# EAGLE design piezo-jfet-buffer-simple-2x v2 (EAGLE 7.5.0)
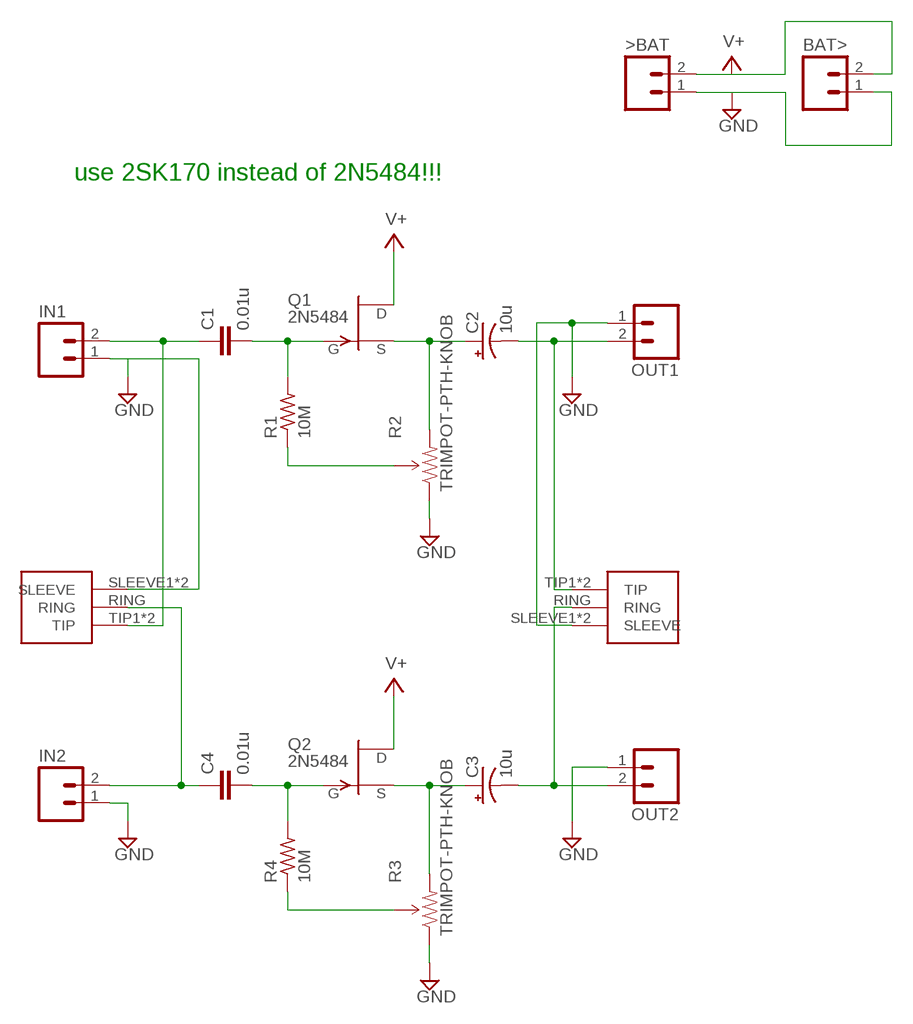
[diagram p0: schematic, sheet 1]

## Parts
>BAT  M02PTH  [1X02]
BAT>  M02PTH  [1X02]
C1  0.01u  C5/3  [C5B3]
C2  10u  CAP_POLPTH2  [CPOL-RADIAL-10UF-25V]
C3  10u  CAP_POLPTH2  [CPOL-RADIAL-10UF-25V]
C4  0.01u  C5/3  [C5B3]
IN1  M02LOCK  [1X02_LOCK]
IN2  M02LOCK  [1X02_LOCK]
OUT1  M02LOCK  [1X02_LOCK]
OUT2  M02LOCK  [1X02_LOCK]
Q1  2N5484  [TO92-]
Q2  2N5484  [TO92-]
R1  10M  R-US_0204/2V  [0204V]
R2  TRIMPOT-PTH-KNOB  [3386U]
R3  TRIMPOT-PTH-KNOB  [3386U]
R4  10M  R-US_0204/2V  [0204V]
U$1  1/8"-F-STEREO-PCB  [1/8"-F-STEREO-PCB]
U$2  1/8"-F-STEREO-PCB  [1/8"-F-STEREO-PCB]

## Nets
CH1: C2.2(-) OUT1.2 U$1.TIP1(TIP) U$1.TIP2(TIP)
CH2: C3.2(-) OUT2.2 U$1.RING
GND: >BAT.1 BAT>.1 IN1.1 IN2.1 OUT1.1 OUT2.1 R2.1(CCW) R3.1(CCW) U$1.SLEEVE1(SLEEVE) U$1.SLEEVE2(SLEEVE) U$2.SLEEVE1(SLEEVE) U$2.SLEEVE2(SLEEVE)
JFET-GATE: C1.2 Q1.1(G) R1.2
JFET-GATE1: C4.2 Q2.1(G) R4.2
JFET-SOURCE: C2.1(+) Q1.2(S) R2.3(CW)
JFET-SOURCE1: C3.1(+) Q2.2(S) R3.3(CW)
N$1: R3.2(WIPER) R4.1
N$2: C1.1 IN1.2 U$2.TIP1(TIP) U$2.TIP2(TIP)
N$3: R1.1 R2.2(WIPER)
N$4: C4.1 IN2.2 U$2.RING
V+: >BAT.2 BAT>.2 Q1.3(D) Q2.3(D)

## Notes on the sheet
- use 2SK170 instead of 2N5484!!!

## Library data of the parts
>BAT BAT> IN1 IN2 OUT1 OUT2 = SparkFun-Connectors:M02: Header 2 Standard 2-pin 0.1" header. Use with straight break away headers (SKU : PRT-00116), right angle break away headers (PRT-00553), swiss pins (PRT-00743), machine pins (PRT-00117), and female headers (PRT-00115). Molex polarized connector foot print use with SKU : PRT-08233 with associated crimp pins and housings.
C1 C4 = capacitor-wima:C: CAPACITOR naming: grid - package width
C2 C3 = SparkFun-Passives:CAP_POL: Capacitor Polarized These are standard SMD and PTH capacitors. Normally 10uF, 47uF, and 100uF in electrolytic and tantalum varieties. Always verify the external diameter of the through hole cap, it varies with capacity, voltage, and manufacturer. The EIA devices should be standard.
Q1 Q2 = transistor-fet:?548*: N-Channel JFETs Source: VISHAY 2N5484.pdf Compatible: TO92 2N5245 J304 J305 U310 J308 J309 J310 TO72 2N4416 2N4416A 2N3823 2N4351 3N169 3N170 3N171 MFE3002 TO18 2N3796 2N3797 MFE825 Source: Motorola European Master Guide Pacge 3-59
R1 R4 = resistor:R-US_: RESISTOR, American symbol
R2 R3 = SparkFun-Electromechanical:TRIMPOT: Various small potentiometers for "set-and-forget" applications
U$1 U$2 = CMU-ArtFab:1/8"-F-STEREO-PCB

## Board
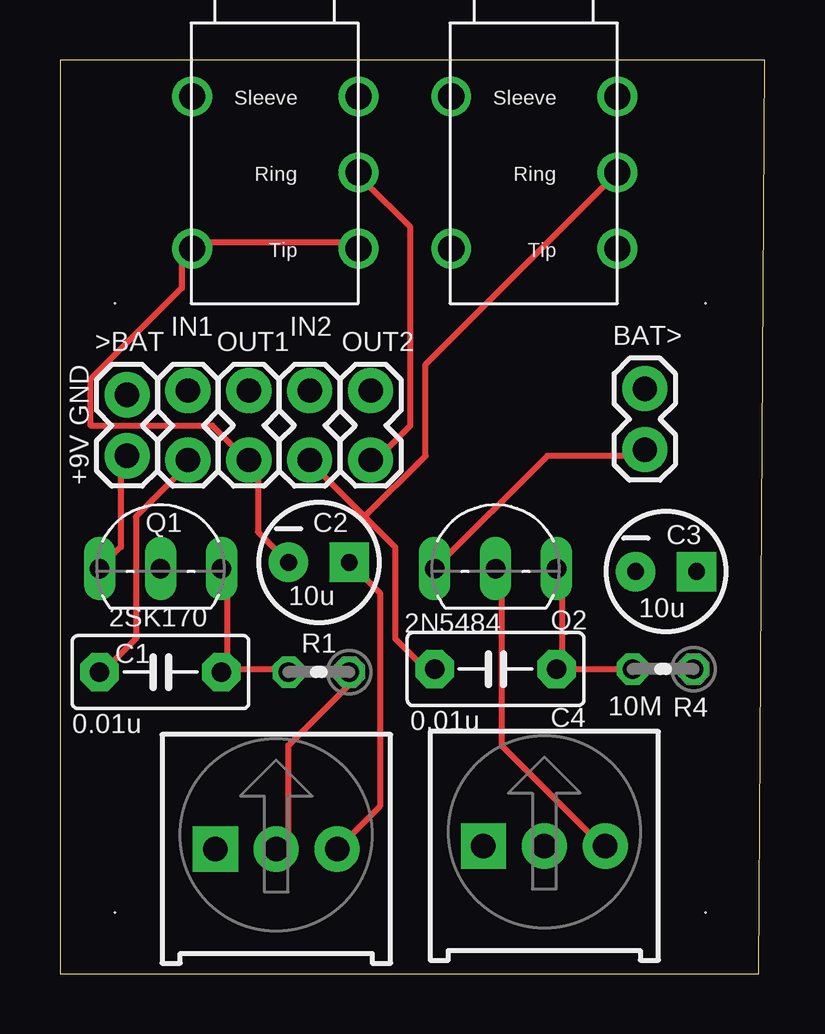
[diagram p1: board, top side]
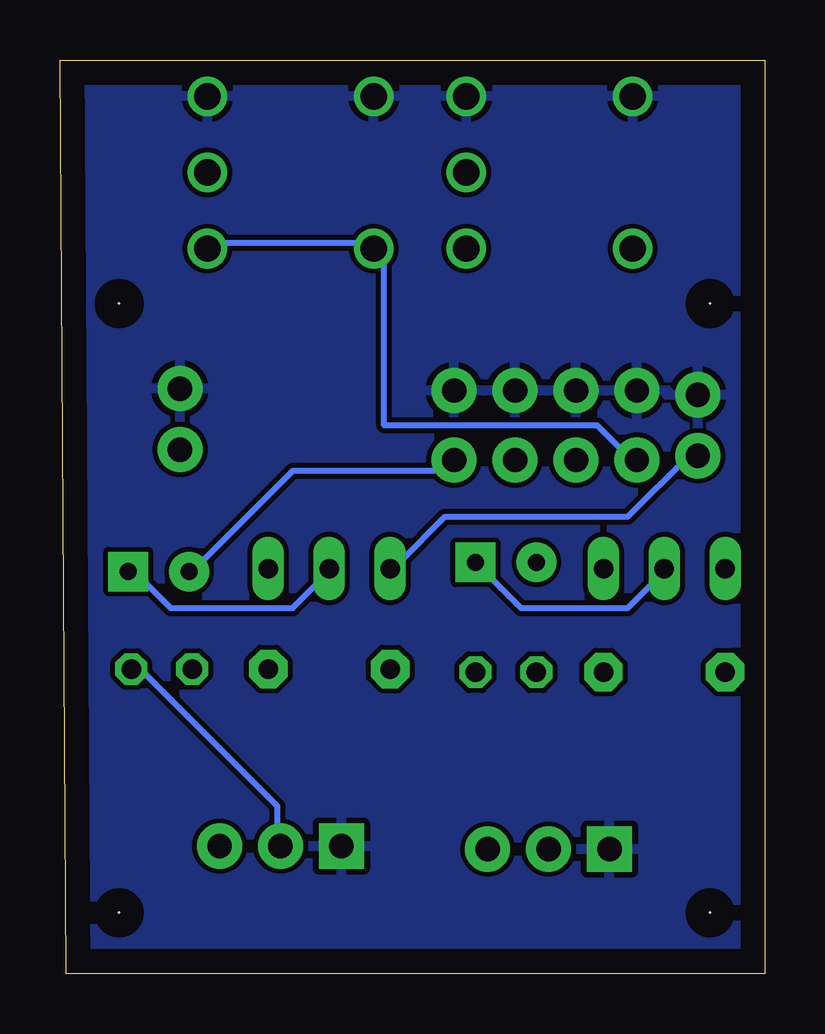
[diagram p2: board, bottom side, seen from below]

Size 29.39 x 38.09 mm. Coordinates in mm from the lower left corner, seen from the top.
Outline: 0,0 29.13,0 29.39,38.09 0,38.09 0,0
Copper layers (1*16): Top 0.035mm / dielectric 1.5mm / Bottom 0.035mm
Design rules "default": minimum track width 10mil, minimum drill 24mil, track to track 8mil, track to pad 8mil, pad to pad 8mil, via to via 8mil, smd to smd 8mil, copper to edge 40mil, drill to drill 8mil, minimum pad ring 10mil, minimum via ring 8mil, stop-mask expansion 4mil, vias tented up to drill 0mil, thermal gap 10mil
Holes 0 mm at 2.29,2.54 26.92,2.54 26.92,27.94 2.29,27.94

### Footprints (pad centres in the part's own frame; a part is rotated, then mirrored left to right if it is on the bottom)
1X02 = drill 1.016 pad 1.88: 1 0,0; 2 2.54,0
C5B3 = drill 0.813 pad 1.6 octagon: 1 -2.54,0; 2 2.54,0
CPOL-RADIAL-10UF-25V = drill 0.7 pad 1.651 square: 1 1.27,0 | drill 0.7 pad 1.651: 2 -1.27,0
1X02_LOCK = drill 1.016 pad 1.88: 1 -0.178,0; 2 2.718,0
TO92- = drill 0.813 long: 1 2.54,0; 2 0,0; 3 -2.54,0
0204V = drill 0.813 octagon: 1 -1.27,0; 2 1.27,0
3386U = drill 1.016 pad 1.88 square: 1 -2.54,-0.015 | drill 1.016 pad 1.88: 2 0,-0.015; 3 2.54,-0.015
1/8"-F-STEREO-PCB = drill 1.1: RING 5.461,0; SLEEVE1 8.636,6.934; SLEEVE2 8.636,0; TIP1 2.286,6.934; TIP2 2.286,0

### Placement (x,y rotation side)
>BAT  2.79,24.13 270 top
BAT>  24.38,24.38 270 top
C1  4.19,12.57 0 top
C2  10.79,17.14 0 top
C3  25.27,16.76 0 top
C4  18.16,12.7 0 top
IN1  5.33,24.13 270 top
IN2  10.41,24.13 270 top
OUT1  7.87,24.13 270 top
OUT2  12.95,24.13 270 top
Q1  4.19,16.89 0 top
Q2  18.16,16.89 0 top
R1  10.79,12.57 180 top
R2  9.02,5.21 0 top
R3  20.19,5.33 0 top
R4  25.15,12.7 180 top
U$1  12.45,27.94 90 top
U$2  23.24,27.94 90 top

### Tracks (layer width: path | path; a pad name or v marks a point on that pad's centre or on a via)
CH1
  Top 0.254: C2.2 8.26,18.41 8.26,20.95 OUT1.2 7.62,21.59 6.35,22.86 1.27,22.86 1.27,24.77 5.08,28.57 5.08,29.84 U$1.TIP1 5.71,30.48 12.06,30.48 U$1.TIP2
CH2
  Top 0.254: U$1.RING 12.7,33.02 14.61,31.11 14.61,22.86 13.34,21.59 OUT2.2
  Bottom 0.254: C3.2 23.5,17.14 19.68,20.95 13.34,20.95 OUT2.2
GND
  pour Bottom: 0.25,37.85 29.46,37.85 29.21,0 0,0
JFET-GATE
  Top 0.254: 6.99,12.7 9.53,12.7 R1.2 | 6.99,12.7 6.99,16.51 Q1.1 | 6.99,12.7 C1.2
JFET-GATE1
  Top 0.254: 20.95,12.7 R4.2 | 20.95,12.7 20.95,16.51 Q2.1 | 20.95,12.7 C4.2
JFET-SOURCE
  Top 0.254: C2.1 13.34,15.88 13.34,6.99 12.06,5.71 R2.3
  Bottom 0.254: C2.1 10.16,15.24 5.71,15.24 4.45,16.51 Q1.2
JFET-SOURCE1
  Top 0.254: R3.3 22.23,5.71 18.41,9.53 18.41,16.51 Q2.2
  Bottom 0.254: Q2.2 18.41,16.51 19.68,15.24 24.77,15.24 26.04,16.51 C3.1
N$1
  Bottom 0.254: R4.1 26.04,12.7 20.32,6.99 20.32,5.71 R3.2
N$2
  Top 0.254: C1.1 1.91,12.7 3.17,13.97 3.17,19.05 5.08,20.95 IN1.2
  Bottom 0.254: U$2.TIP2 22.86,30.48 16.51,30.48 U$2.TIP1 15.88,29.84 15.88,22.86 6.99,22.86 5.71,21.59 IN1.2
N$3
  Top 0.254: R1.1 12.06,12.06 9.53,9.53 9.53,5.71 R2.2
N$4
  Top 0.254: 12.7,19.05 10.79,20.95 IN2.2 | 12.7,19.05 13.97,17.78 13.97,13.97 15.24,12.7 C4.1 | U$2.RING 15.24,25.4 15.24,21.59 12.7,19.05
V+
  Top 0.254: Q1.3 2.54,17.78 2.54,21.59 >BAT.2 | Q2.3 20.32,21.59 24.13,21.59 BAT>.2
  Bottom 0.254: >BAT.2 3.17,21.59 5.71,19.05 13.34,19.05 15.24,17.14 Q2.3

### Text on the board
tNames: GND | +9V | 2SK170